# Altium schematic sheet FP6296.schdoc
size 127 x 101 mm
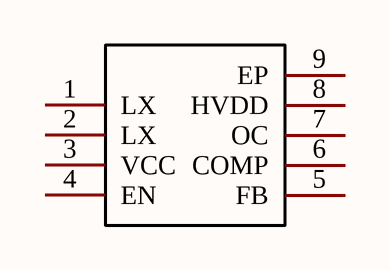
[diagram p0: FP6296.schdoc]

## Parts
U?  FP6296XR-G1  [SOP-8_L4.9-W3.9-P1.27-LS6.0-BL-EP]  (value not drawn)

## Nets

Not connected (* = marked no-connect by the designer): U? 1(LX) 2(LX) 3(VCC) 4(EN) 5(FB) 6(COMP) 7(OC) 8(HVDD) 9(EP)

## Library data of the parts
U? = FP6296XR-G1: Manufacturer: Advanced Analog Technology(类比); Add into BOM: yes; Function: 升压型; Synchronous Rectification: 否; Number of Outputs: 1; Topology: 升压式; Input Voltage: 2.7V~12V; Output Voltage: 13V; Output Current (Max): 10A; Switching Frequency: 400kHz; Symbol: FP6296XR-G1; Device: FP6296XR-G1; LCSC Part Name: 升压型 Vin=2.7V~12V Vout=13V 10A; Supplier Part: C133888; Manufacturer Part: FP6296XR-G1; Supplier Footprint: SOP-8-EP-150mil; JLCPCB Part Class: Extended Part; Datasheet: https://atta.szlcsc.com/upload/public/pdf/source/20171014/C133888_15079755382361038280.pdf; Supplier: LCSC; Convert to PCB: yes